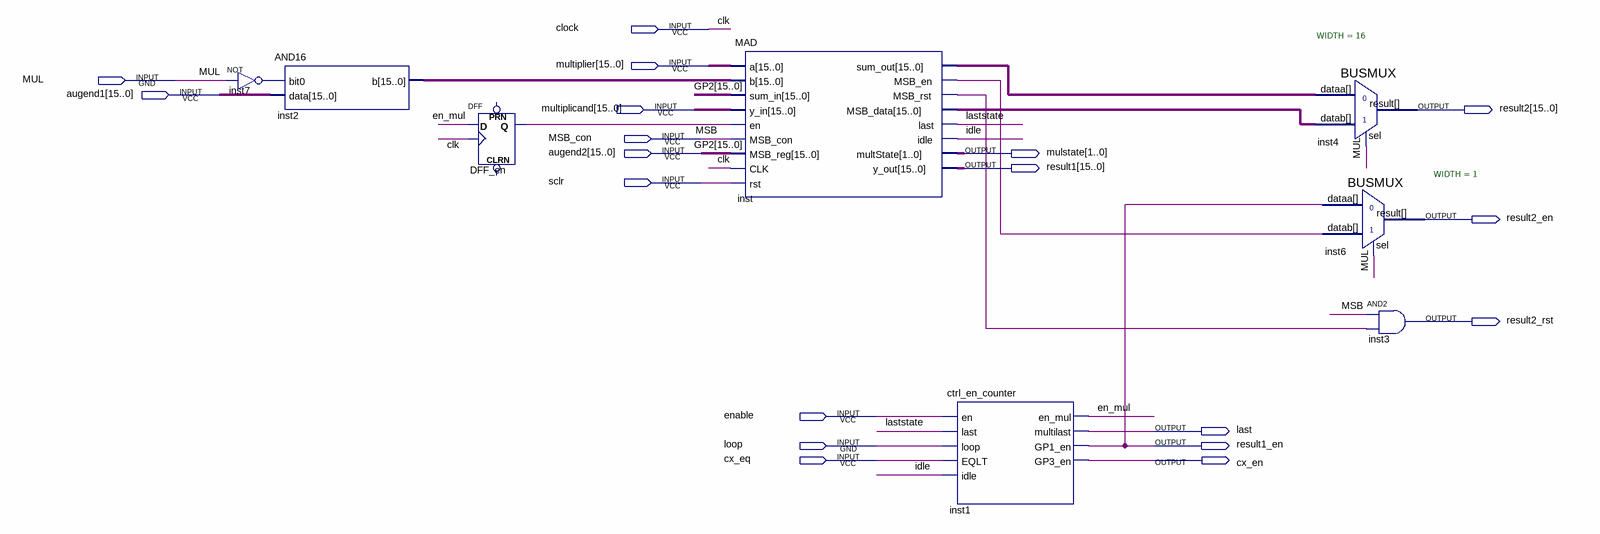
[diagram p0: schematic sheet]
// Quartus schematic MAC_loop.bdf as structural Verilog: 8 symbols, 19 pins
module MAC_loop (
  input  clock,
  input  [15:0] multiplier,
  input  MUL,
  input  [15:0] augend1,
  input  [15:0] multiplicand,
  input  MSB_con,
  input  [15:0] augend2,
  input  sclr,
  input  enable,
  input  loop,
  input  cx_eq,
  output [15:0] result2,
  output [1:0] mulstate,
  output [15:0] result1,
  output result2_en,
  output result2_rst,
  output last,
  output result1_en,
  output cx_en
);

  wire DFF_en_q, en_mul, idle, inst7_out, inst_msb_en, inst_msb_rst, laststate;
  wire [15:0] inst2_b, inst_msb_data, inst_sum_out;

  AND16 inst2 (.bit0(inst7_out), .data(augend1), .b(inst2_b));
  not inst7 (inst7_out, MUL);
  DFF DFF_en (.CLK(clock), .D(en_mul), .Q(DFF_en_q));  // open: CLRN, PRN
  MAD inst (
    .a(multiplier), .b(inst2_b), .sum_in(augend2), .y_in(multiplicand), .en(DFF_en_q), .MSB_con(MSB_con),
    .MSB_reg(augend2), .CLK(clock), .rst(sclr), .sum_out(inst_sum_out), .MSB_en(inst_msb_en),
    .MSB_rst(inst_msb_rst), .MSB_data(inst_msb_data), .last(laststate), .idle(idle), .multState(mulstate),
    .y_out(result1));
  ctrl_en_counter inst1 (
    .en(enable), .last(laststate), .loop(loop), .EQLT(cx_eq), .idle(idle), .en_mul(en_mul), .multilast(last),
    .GP1_en(result1_en), .GP3_en(cx_en));
  BUSMUX #(.WIDTH(16)) inst4 (.datab(inst_msb_data), .sel(MUL), .dataa(inst_sum_out), .result(result2));
  BUSMUX #(.WIDTH(1)) inst6 (.datab(inst_msb_en), .sel(MUL), .dataa(result1_en), .result(result2_en));
  and inst3 (result2_rst, MSB_con, inst_msb_rst);

  // Other names for the same wires on the sheet: clk = clock; GP2[15:0] = augend2; MSB = MSB_con
endmodule
